# EAGLE design SAM 15x15 v4 (EAGLE 7.6.0)
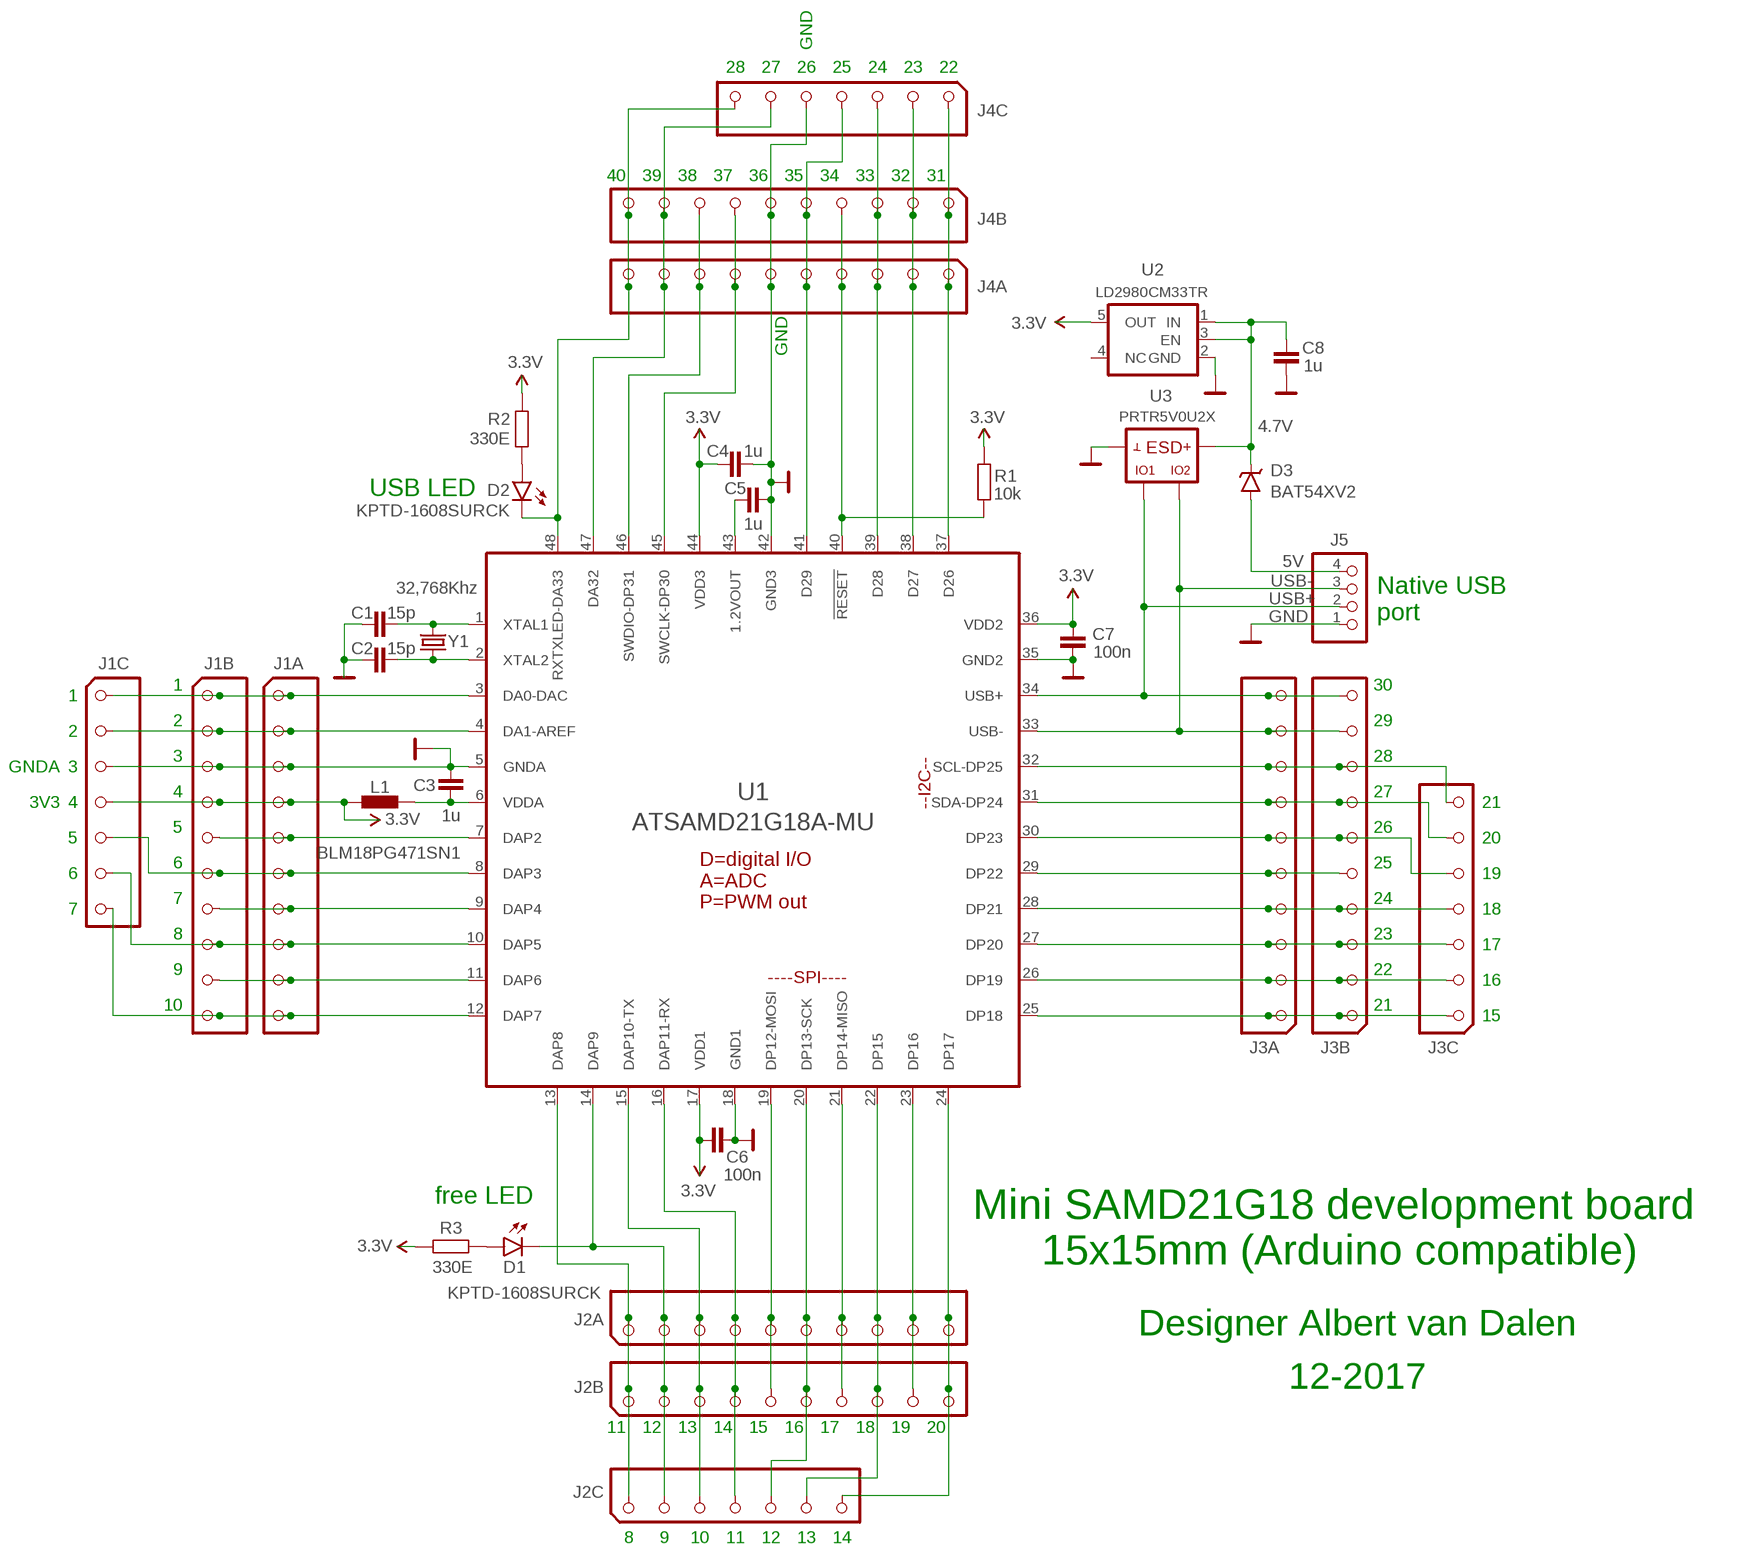
[diagram p0: schematic, sheet 1]
V1 (ARROW): VALUE: x
V2 (ARROW): VALUE: x
V3 (ARROW): VALUE: x
V4 (ARROW): VALUE: x
V5 (ARROW): VALUE: x
V11 (ARROW): VALUE: x
V12 (ARROW): VALUE: x
V98 (ARROW): VALUE: x

## Parts
C1  15p  SMD-C-0402-SMALL  [0402-SMALL]
C2  15p  SMD-C-0402-SMALL  [0402-SMALL]
C3  1u  SMD-C-0402-SMALL  [0402-SMALL]
C4  1u  SMD-C-0402-SMALL  [0402-SMALL]
C5  1u  SMD-C-0402-SMALL  [0402-SMALL]
C6  100n  SMD-C-0402-SMALL  [0402-SMALL]
C7  100n  SMD-C-0402-SMALL  [0402-SMALL]
C8  1u  SMD-C-0402-SMALL  [0402-SMALL]
D1  KPTD-1608SURCK  LED  [LED-0603]
D2  KPTD-1608SURCK  LED  [LED-0603]
D3  BAT54XV2  DIODE-SMDSOD523  [SOD523]
J1A  JST-10SAM50  [1.27MM-10P-SAM50]
J1B  JST-101X10  [1X10]
J1C  SAM7SAM7  [SAM7]
J2A  JST-10SAM50  [1.27MM-10P-SAM50]
J2B  JST-101X10  [1X10]
J2C  SAM7SAM7  [SAM7]
J3A  JST-10SAM50  [1.27MM-10P-SAM50]
J3B  JST-101X10  [1X10]
J3C  SAM7SAM7  [SAM7]
J4A  JST-10SAM50  [1.27MM-10P-SAM50]
J4B  JST-101X10  [1X10]
J4C  SAM7SAM7  [SAM7]
J5  Header 4p  JST-41X04  [1X04]
L1  BLM18PG471SN1  ARDUINO_INDUCTOR-0603  [ARDUINO_C0603]
R1  10k  SMD-R-0402-SMALL  [0402-SMALL]
R2  330E  SMD-R-0402-SMALL  [0402-SMALL]
R3  330E  SMD-R-0402-SMALL  [0402-SMALL]
U1  ATSAMD21G18A-MU  ATSAMD21G-M  [QFN-48]
U2  LD2980CM33TR  AP2112K-3.3TRG1  [SOT23-5]
U3  PRTR5V0U2X  [SOT143B]
Y1  32,768Khz  CRYSTAL-SMD  [CRYSTAL-SMD-3.2X1.5MM]

## Nets
3.3V: C4.2 C6.2 C7.2 J1A.4 J1B.4 J1C.4 L1.1 R1.2 R2.2 R3.2 U1.17(VDD1) U1.36(VDD2) U1.44(VDD3) U2.5(OUT)
4.7V: C8.2 D3.C U2.1(IN) U2.3(EN) U3.4(VCC)
5V: D3.A J5.4
GND: C1.2 C2.2 C3.2 C4.1 C5.1 C6.1 C7.1 C8.1 J1A.3 J1B.3 J1C.3 J4A.6 J4B.6 J4C.5 J5.1 U1.5(GNDA) U1.18(GND1) U1.35(GND2) U1.42(GND3) U2.2(GND) U3.1(GND) ; supply symbol labelled GND2
N$1: D2.A R2.1
N$2: J2A.8 J2B.8 J2C.6 U1.22(DP15)
N$3: J1A.1 J1B.1 J1C.1 U1.3(DA0-DAC)
N$4: J1A.2 J1B.2 J1C.2 U1.4(DA1-AREF)
N$5: J1A.5 J1B.5 U1.7(DAP2)
N$6: J1A.6 J1B.6 J1C.5 U1.8(DAP3)
N$7: J1A.7 J1B.7 U1.9(DAP4)
N$9: J2A.3 J2B.3 J2C.3 U1.15(DAP10-TX)
N$10: J1A.8 J1B.8 J1C.6 U1.10(DAP5)
N$11: D1.C J2A.2 J2B.2 J2C.2 U1.14(DAP9)
N$12: J2A.1 J2B.1 J2C.1 U1.13(DAP8)
N$13: J2A.5 J2B.5 U1.19(DP12-MOSI)
N$14: J3A.5 J3B.5 U1.29(DP22)
N$15: J2A.7 J2B.7 U1.21(DP14-MISO)
N$16: J3A.7 J3B.7 J3C.6 U1.31(SDA-DP24)
N$17: J2A.9 J2B.9 U1.23(DP16)
N$18: J3A.1 J3B.1 J3C.1 U1.25(DP18)
N$19: J3A.2 J3B.2 J3C.2 U1.26(DP19)
N$20: J3A.3 J3B.3 J3C.3 U1.27(DP20)
N$21: J3A.4 J3B.4 J3C.4 U1.28(DP21)
N$24: J1A.9 J1B.9 U1.11(DAP6)
N$25: J3A.8 J3B.8 J3C.7 U1.32(SCL-DP25)
N$26: D1.A R3.1
N$27: J2A.6 J2B.6 J2C.5 U1.20(DP13-SCK)
N$29: J1A.10 J1B.10 J1C.7 U1.12(DAP7)
N$30: J4A.5 J4B.5 J4C.4 U1.41(D29)
N$31: J4A.4 J4B.4 R1.1 U1.40(!RESET!)
N$32: J4A.7 J4B.7 U1.45(SWCLK-DP30)
N$33: J4A.8 J4B.8 U1.46(SWDIO-DP31)
N$35: D2.C J4A.10 J4B.10 J4C.7 U1.48(RXTXLED-DA33)
N$36: J4A.3 J4B.3 J4C.3 U1.39(D28)
N$37: J4A.2 J4B.2 J4C.2 U1.38(D27)
N$38: J2A.10 J2B.10 J2C.7 U1.24(DP17)
N$39: J4A.1 J4B.1 J4C.1 U1.37(D26)
N$43: J2A.4 J2B.4 J2C.4 U1.16(DAP11-RX)
N$44: J3A.6 J3B.6 J3C.5 U1.30(DP23)
N$47: J4A.9 J4B.9 J4C.6 U1.47(DA32)
N$68: C1.1 U1.1(XTAL1) Y1.P$2
N$109: C2.1 U1.2(XTAL2) Y1.P$1
N$111: C5.2 U1.43(1.2VOUT)
USB+: J3A.10 J3B.10 J5.2 U1.34(USB+) U3.3(IO1)
USB-: J3A.9 J3B.9 J5.3 U1.33(USB-) U3.2(IO2)
VDDA: C3.1 L1.2 U1.6(VDDA)
Unconnected: U2.4(NC)

## Notes on the sheet
- GND
- 28 | 27 | 26 | 25 | 24 | 23 | 22
- 40 | 39 | 38 | 37 | 36 | 35 | 34 | 33 | 32 | 31
- GND
- USB LED
- Native USB 
  port
- 1 | 30
- 1
- 2 | 29
- 2
- 3 | 28
- GNDA | 3
- 4 | 27
- 3V3 | 4 | 21
- 5 | 26
- 5 | 20
- 6 | 25
- 6 | 19
- 7 | 24
- 7 | 18
- 8 | 23
- 17
- 9 | 22
- 16
- 10 | 21
- 15
- free LED
- Mini SAMD21G18 development board 
  15x15mm (Arduino compatible)
- Designer Albert van Dalen
- 12-2017
- 11 | 12 | 13 | 14 | 15 | 16 | 17 | 18 | 19 | 20
- 8 | 9 | 10 | 11 | 12 | 13 | 14

## Library data of the parts
C1-C8 = Albert:SMD-C: Capacitors ...4.7uF @ 6.3V -> 0402 ...10uF @ 16V -> 0603 ...22uF @ 25V -> 0805
D1 D2 = Albert:LED
D3 = Albert:DIODE-SMD
J1A J1B J2A J2B J3A J3B J4A J4B = Albert:JST-10
J1C J2C J3C J4C = Albert:SAM7
J5 = Albert:JST-4
L1 = Arduino-Zero:ARDUINO_INDUCTOR: Inductors
R1-R3 = Albert:SMD-R: Resistors all kinds in 0603 and 0402
U1 = Albert-Arduino:ATSAMD21G: Atmel SAMD21G SMART ARM-Based Microcontroller The Atmel ® | SMART  SAM D21 is a series of low-power microcontrollers using the 32-bit ARM ® Cortex ® -M0+ processor, and ranging from 32- to 64-pins with up to 256KB Flash and 32KB of SRAM. The SAM D21 devices operate at a maximum frequency of 48MHz and reach 2.46 CoreMark/MHz. They are designed for simple and intuitive migration with identical peripheral modules, hex compatible code, identical linear address map and pin compatible migration paths between all devices in the product series. All devices include intelligent and flexible peripherals, Atmel Event System for inter-peripheral signaling, and support for capacitive touch button, slider and wheel user interfaces.
U2 = Albert:AP2112K: Voltage Regulator LDO Standard 150mA LDO voltage regulator in SOT-23 layout. Micrel part MIC5205. BP (by-pass) pin is used to lower output noise with 470pF cap.
U3 = Albert:PRTR5V0U2X
Y1 = Albert:CRYSTAL-SMD: 32,768KHz - SMD

## Net classes
2 GND: width 0.406 mm
3 usbvcc: width 0.102 mm, drill 0.1 mm, clearance 0.15 mm

## Board
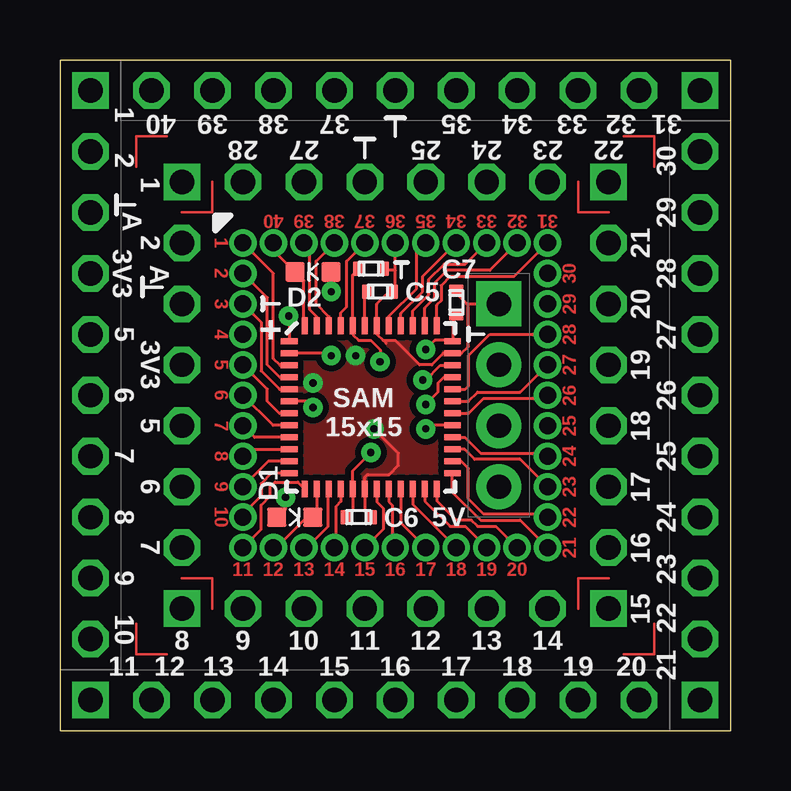
[diagram p1: board, top side]
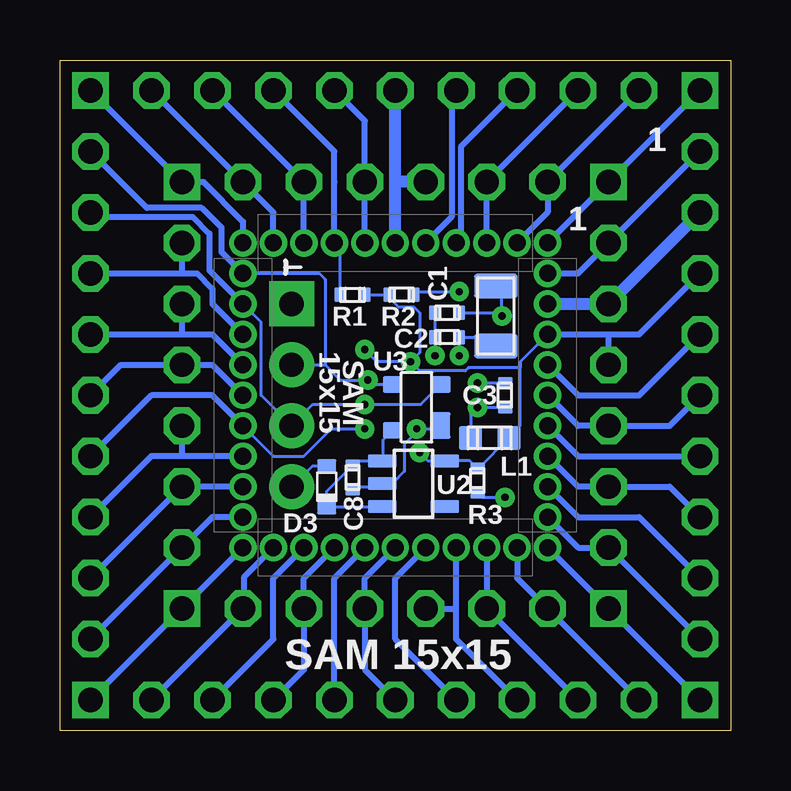
[diagram p2: board, bottom side, seen from below]

Size 27.94 x 27.94 mm. Coordinates in mm from the lower left corner, seen from the top.
Outline: 0,0 27.94,0 27.94,27.94 0,27.94 0,0
Copper layers (1*16): Top 0.035mm / dielectric 1.5mm / Bottom 0.035mm
Design rules "Albert 5mil": minimum track width 5mil, minimum drill 0.3mm, track to track 5mil, track to pad 5mil, pad to pad 5mil, via to via 5mil, smd to smd 5mil, copper to edge 10mil, drill to drill 8mil, minimum pad ring 8.5mil, minimum via ring 10mil, stop-mask expansion 4mil, vias tented up to drill 25mil, thermal gap 10mil

### Footprints (pad centres in the part's own frame; a part is rotated, then mirrored left to right if it is on the bottom)
0402-SMALL = smd 0.6 x 0.5: 1 0,0.5; 2 0,-0.5
LED-0603 = smd 0.8 x 0.8: A 0,-0.75; C 0,0.75
SOD523 = smd 0.6 x 0.8: A 0.85,0; C -0.85,0
1.27MM-10P-SAM50 = drill 0.7 pad 1.143: 1 0,0; 2 1.27,0; 3 2.54,0; 4 3.81,0; 5 5.08,0; 6 6.35,0; 7 7.62,0; 8 8.89,0; 9 10.16,0; 10 11.43,0
1X10 = drill 1.016 square: 1 0,0 | drill 1.016 octagon: 2 2.54,0; 3 5.08,0; 4 7.62,0; 5 10.16,0; 6 12.7,0; 7 15.24,0; 8 17.78,0; 9 20.32,0; 10 22.86,0
SAM7 = drill 1.016 square: 1 0,0 | drill 1.016 octagon: 2 2.54,0; 3 5.08,0; 4 7.62,0; 5 10.16,0; 6 12.7,0; 7 15.24,0
1X04 = drill 1.016 pad 1.88 square: 1 0,0 | drill 1.016 pad 1.88: 2 2.54,0; 3 5.08,0; 4 7.62,0
ARDUINO_C0603 = smd 1 x 0.95: 1 0,0.8; 2 0,-0.8
QFN-48 = smd 0.7 x 0.25: 1 -3.4,2.75; 2 -3.4,2.25; 3 -3.4,1.75; 4 -3.4,1.25; 5 -3.4,0.75; 6 -3.4,0.25; 7 -3.4,-0.25; 8 -3.4,-0.75; 9 -3.4,-1.25; 10 -3.4,-1.75; 11 -3.4,-2.25; 12 -3.4,-2.75; 25 3.4,-2.75; 26 3.4,-2.25; 27 3.4,-1.75; 28 3.4,-1.25; 29 3.4,-0.75; 30 3.4,-0.25; 31 3.4,0.25; 32 3.4,0.75; 33 3.4,1.25; 34 3.4,1.75; 35 3.4,2.25; 36 3.4,2.75 | smd 0.25 x 0.7: 13 -2.75,-3.4; 14 -2.25,-3.4; 15 -1.75,-3.4; 16 -1.25,-3.4; 17 -0.75,-3.4; 18 -0.25,-3.4; 19 0.25,-3.4; 20 0.75,-3.4; 21 1.25,-3.4; 22 1.75,-3.4; 23 2.25,-3.4; 24 2.75,-3.4; 37 2.75,3.4; 38 2.25,3.4; 39 1.75,3.4; 40 1.25,3.4; 41 0.75,3.4; 42 0.25,3.4; 43 -0.25,3.4; 44 -0.75,3.4; 45 -1.25,3.4; 46 -1.75,3.4; 47 -2.25,3.4; 48 -2.75,3.4
SOT23-5 = smd 0.55 x 1.2: 1 -0.95,-1.3; 2 0,-1.3; 3 0.95,-1.3; 4 0.95,1.3; 5 -0.95,1.3
SOT143B = smd 1.1 x 0.8: 1 -0.75,-1 | smd 0.7 x 0.8: 2 0.95,-1; 3 0.95,1; 4 -0.95,1
CRYSTAL-SMD-3.2X1.5MM = smd 1 x 1.8: P$1 -1.25,0; P$2 1.25,0

### Placement (x,y rotation side)
C1  11.81,17.4 270 bottom
C2  11.81,16.38 270 bottom
C3  9.4,13.97 180 bottom
C4  12.95,19.24 270 top
C5  13.34,18.29 270 top
C6  12.45,8.89 270 top
C7  16.51,17.84 0 top
C8  15.75,10.54 180 bottom
D1  9.78,8.89 270 top
D2  10.54,19.11 90 top
D3  16.83,10.16 90 bottom
J1A  7.62,20.32 270 top
J1B  1.27,26.67 270 top
J1C  5.08,22.86 270 top
J2A  7.62,7.62 0 top
J2B  1.27,1.27 0 top
J2C  5.08,5.08 0 top
J3A  20.32,7.62 90 top
J3B  26.67,1.27 90 top
J3C  22.86,5.08 90 top
J4A  20.32,20.32 180 top
J4B  26.67,26.67 180 top
J4C  22.86,22.86 180 top
J5  18.29,17.78 270 top
L1  10.03,12.19 270 bottom
R1  15.75,18.16 90 bottom
R2  13.72,18.16 270 bottom
R3  10.54,10.41 180 bottom
U1  12.95,13.46 0 top
U2  13.21,10.29 270 bottom
U3  13.08,13.46 90 bottom
Y1  9.78,17.27 90 bottom

### Tracks (layer width: path | path; a pad name or v marks a point on that pad's centre or on a via)
3.3V  (via drill 0.3)
  Top 0.127: C6.2 12.2,9.15 U1.17 12.19,10.07 12.19,10.82 v12.95,11.58 | U1.44 12.2,18.99 C4.2 | U1.36 16.13,16.18 16.26,16.26 | U1.44 | 16.26,16.26 15.62,16.26 v15.24,15.88 | U1.44 12.2,16.5 12.45,16.26 12.95,16.26 13.34,15.88 v13.34,15.37 | 16.26,16.26 16.38,16.26 16.38,17.22 C7.2
  Bottom 0.127: 8.76,15.11 10.92,15.11 11.05,14.99 12.95,14.99 v13.34,15.37 | 9.14,12.03 L1.1 | L1.1 9.11,12.36 8.76,12.7 8.76,15.11 | R1.2 R2.2 14.22,18.03 13.84,17.65 13.21,17.65 12.95,17.4 12.95,15.75 v13.34,15.37 | J1A.4 8.76,15.37 8.76,15.11 | v12.95,11.58 12.61,11.24 U2.5 10.86,11.24 R3.2 10.51,10.91 L1.1 | v13.34,15.37 14.73,15.37 v15.24,15.88
  Bottom 0.254: J1A.4 5.08,16.51 | 5.08,16.51 3.81,16.51 J1B.4 | J1C.4 5.08,16.51
4.7V
  Bottom 0.127: 14.69,11.29 U2.1 | U2.1 15.68,11.24 C8.2 16.83,9.97 D3.C 14.66,9.31 U2.3 | U2.1 14.48,11.27 14.48,12.12 U3.4
5V
  Bottom 0.127: D3.A 17.44,11.01 J5.4
GND  (via drill 0.3)
  Top 0.127: 13.2,17.78 U1.42 13.21,16.51 13.46,16.26 | 13.2,17.78 13.58,18.15 C5.1 13.97,18.42 13.97,19.18 | 13.97,19.18 J4A.6 | C6.1 12.7,9.13 U1.18 12.7,10.54 12.83,10.67 13.72,10.67 14.1,11.05 14.1,11.56 v13.08,12.57 | J1A.3 8.38,17.02 8.38,14.99 9.16,14.21 U1.5 | 13.97,19.18 13.52,19.18 C4.1 | 13.2,17.78 13.21,17.77 | 13.46,16.26 13.97,16.26 14.99,15.24 15.49,15.24 15.97,15.71 U1.35 16.73,15.71 17.02,16 17.02,17.78 | 13.46,16.26 13.59,16.13 | 17.02,17.78 J5.1 | 17.02,17.78 16.95,17.78 16.51,18.22 C7.1
  Bottom 0.127: C1.2 C2.2 12.31,15.76 v12.32,15.62 | C3.2 v10.54,14.48 | U3.1 12.09,12.57 v13.08,12.57 13.08,12.45 13.59,11.94 13.59,10.79 14.1,10.29 U2.2 | 14.64,10.29 U2.2 | C8.1 15.75,10.16 14.63,10.16 U2.2 | 14.99,10.29 U2.2
  Bottom 0.508: J1A.3 J1C.3 J1B.3 | J4A.6 13.97,22.86 | 13.97,22.86 J4B.6 | J4C.5 13.97,22.86
  pour Top (isolate 0.254): 9.4,17.02 16.51,17.02 16.51,9.91 9.4,9.91
N$1  (via drill 0.3)
  Top 0.127: v11.3,18.29 v11.29,18.3 D2.A
  Bottom 0.127: R2.1 13.09,18.29 v11.3,18.29
N$2
  Top 0.127: U1.22 14.7,9.43 J2A.8
  Bottom 0.254: J2B.8 17.78,2.54 J2C.6 17.78,6.35 J2A.8
N$3
  Top 0.127: U1.3 9.17,15.21 8.89,15.49 8.89,19.05 J1A.1
  Bottom 0.254: J1A.1 J1C.1 J1B.1
N$4
  Top 0.127: U1.4 9.16,14.71 8.64,15.24 8.64,18.03 J1A.2
  Bottom 0.254: J1A.2 6.35,19.05 J1C.2 J1B.2
N$5
  Top 0.127: U1.7 9.14,13.21 8.64,13.72 8.64,14.22 J1A.5
  Bottom 0.254: J1A.5 6.35,13.97 3.81,13.97 J1B.5
N$6
  Top 0.127: U1.8 8.88,12.71 J1A.6
  Bottom 0.254: J1B.6 2.54,12.7 J1C.5 6.35,12.7 J1A.6
N$7
  Top 0.127: U1.9 8.11,12.21 J1A.7
  Bottom 0.254: J1A.7 6.35,11.43 J1B.7
N$8
  Top 0.102: 24.77,23.5 24.77,24.77 23.5,24.77
N$9
  Top 0.127: U1.15 11.18,10.03 11.18,8.51 10.29,7.62 J2A.3
  Bottom 0.254: J2A.3 J2C.3 J2B.3
N$10
  Top 0.127: J1A.8 7.9,11.71 U1.10
  Bottom 0.254: J1A.8 6.35,10.16 J1C.6 2.54,10.16 J1B.8
N$11
  Top 0.127: U1.14 10.7,9.06 D1.C 10.29,8.89 9.02,7.62 J2A.2
  Bottom 0.254: J2A.2 8.89,6.35 7.68,5.14 J2C.2 J2B.2
N$12
  Top 0.127: U1.13 10.2,10.2 | J2A.1 8.38,8.38 8.38,9.4 8.76,9.78 8.76,10.16 8.95,10.35 9.91,10.35 U1.13 | U1.13 10.16,10.11
  Bottom 0.254: J2A.1 5.59,5.59 J2C.1 J2B.1
N$13
  Top 0.127: U1.19 13.2,9.53 13.46,9.27 13.46,8.38 J2A.5
  Bottom 0.254: J2B.5 13.97,3.81 13.97,6.35 J2A.5
N$14  (via drill 0.3)
  Top 0.127: U1.29 15.38,12.71 v15.24,12.57
  Bottom 0.127: J3A.5 19.05,11.43 17.78,11.43 16.64,12.57 v15.24,12.57
  Bottom 0.254: J3A.5 21.59,13.97 24.13,13.97 J3B.5
N$15
  Top 0.127: U1.21 14.2,8.66 J2A.7
  Bottom 0.254: J2B.7 16.51,6.35 J2A.7
N$16
  Top 0.127: J3A.7 19.18,14.1 17.4,14.1 17.01,13.71 U1.31
  Bottom 0.254: J3B.7 22.86,16.51 | 22.86,16.51 21.59,16.51 J3A.7 | J3C.6 22.86,16.51
N$17
  Top 0.127: U1.23 15.2,9.56 16.26,8.51 16.89,8.51 J2A.9
  Bottom 0.254: J2B.9 19.05,3.81 19.05,6.35 J2A.9
N$18
  Top 0.127: J3A.1 19.18,8.76 17.53,8.76 16.35,9.94 U1.25
  Bottom 0.254: J3B.1 J3C.1 J3A.1
N$19
  Top 0.127: J3A.2 20.19,9.02 17.65,9.02 17.02,9.65 17.02,10.92 16.73,11.21 U1.26
  Bottom 0.254: J3A.2 21.59,8.89 J3C.2 J3B.2
N$20
  Top 0.127: J3A.3 19.18,11.3 17.27,11.3 16.86,11.71 U1.27
  Bottom 0.254: J3A.3 J3C.3 J3B.3
N$21
  Top 0.127: J3A.4 20.19,11.56 17.53,11.56 16.87,12.21 U1.28
  Bottom 0.254: J3A.4 22.86,11.43 | 22.86,11.43 24.13,11.43 J3B.4 | J3C.4 22.86,11.43
N$22
  Top 0.102: 4.45,24.77 3.17,24.77 3.17,23.5
N$23
  Top 0.102: 3.17,4.45 3.17,3.17 4.45,3.17
N$24
  Top 0.127: U1.11 8.67,11.21 J1A.9
  Bottom 0.254: J1B.9 3.81,8.89 6.35,8.89 J1A.9
N$25
  Top 0.127: U1.32 16.88,14.21 17.02,14.35 17.02,15.62 17.91,16.51 J3A.8
  Bottom 0.254: J3B.8 22.86,19.05 | 22.86,19.05 22.23,19.05 21.59,18.41 21.59,17.78 J3A.8 | J3C.7 22.86,19.05
N$26  (via drill 0.3)
  Top 0.127: D1.A 9.4,9.26 v9.4,9.72
  Bottom 0.127: R3.1 10.34,9.72 v9.4,9.72
N$27
  Top 0.127: U1.20 13.7,9.54 13.84,9.4 13.84,7.75 J2A.6
  Bottom 0.254: J2B.6 15.24,2.54 J2C.5 15.24,6.35 J2A.6
N$28
  Top 0.102: 6.35,22.86 6.35,21.59 5.08,21.59
N$29
  Top 0.127: U1.12 8.81,10.71 8.38,10.29 8.38,9.78 7.62,9.02 J1A.10
  Bottom 0.254: J1A.10 6.35,7.62 J1C.7 J1B.10
N$30
  Top 0.127: U1.41 13.7,17.26 14.86,18.41 14.86,19.94 J4A.5
  Bottom 0.254: J4A.5 J4C.4 15.24,25.4 J4B.5
N$31
  Top 0.127: U1.40 14.2,17.38 15.11,18.29 15.11,18.92 J4A.4
  Bottom 0.127: R1.1 16.26,20.07 J4A.4
  Bottom 0.254: J4A.4 16.51,22.86 16.51,24.13 J4B.4
N$32
  Top 0.127: 12.45,20.07 J4A.7 11.94,19.56 11.94,17.65 11.7,17.42 U1.45
  Bottom 0.254: J4B.7 11.62,26.48 11.62,21.4 J4A.7
N$33
  Top 0.127: U1.46 11.2,17.24 10.67,17.78 10.67,19.56 J4A.8
  Bottom 0.254: J4B.8 11.24,24.32 11.24,20.51 J4A.8
N$35
  Top 0.127: U1.48 10.16,16.91 10.16,18.74 D2.C 8.89,20.02 J4A.10
  Bottom 0.254: J4A.10 7.62,21.59 J4C.7 J4B.10
N$36
  Top 0.127: J4A.3 16.89,19.43 16,19.43 15.37,18.8 15.37,18.16 14.7,17.5 U1.39
  Bottom 0.254: J4A.3 J4C.3 J4B.3
N$37
  Top 0.127: U1.38 15.2,17.62 15.62,18.03 15.62,18.67 16.13,19.18 17.91,19.18 J4A.2
  Bottom 0.254: J4A.2 19.05,21.59 J4C.2 J4B.2
N$38
  Top 0.127: U1.24 15.7,9.57 16.51,8.76 17.14,8.76 17.4,8.51 18.16,8.51 J2A.10
  Bottom 0.254: J2B.10 J2C.7 20.26,5.14 20.26,6.41 J2A.10
N$39
  Top 0.127: J4A.1 18.92,18.92 16.26,18.92 15.88,18.54 15.88,17.91 15.7,17.74 U1.37
  Bottom 0.254: J4B.1 J4C.1 21.97,22.86 20.32,21.21 J4A.1
N$40
  Top 0.102: 21.59,22.86 21.59,21.59 22.86,21.59
N$41
  Top 0.102: 5.08,6.35 6.35,6.35 6.35,5.08
N$42
  Top 0.102: 22.86,6.35 21.59,6.35 21.59,5.08
N$43
  Top 0.127: U1.16 11.7,9.54 11.49,9.34 11.49,7.68 J2A.4
  Bottom 0.254: J2B.4 11.43,3.81 11.43,5.08 | 11.43,5.08 J2A.4 | J2C.4 11.43,5.08
N$44
  Top 0.127: U1.30 17.02,13.21 17.65,13.84 20.19,13.84 J3A.6
  Bottom 0.254: J3A.6 21.59,15.24 J3C.5 25.4,15.24 J3B.6
N$45
  Top 0.102: 23.5,3.17 24.77,3.17 24.77,4.45
N$47
  Top 0.127: U1.47 10.7,17.24 10.41,17.53 10.41,20.07 J4A.9
  Bottom 0.254: J4B.9 J4C.6 J4A.9
N$68  (via drill 0.3)
  Top 0.127: v9.53,17.27 9.55,17.24 U1.1
  Bottom 0.127: Y1.P$2 9.53,18.27 v9.53,17.27 9.65,17.4 C1.1
N$109  (via drill 0.3)
  Top 0.127: U1.2 9.59,15.75 11.18,15.75 v11.3,15.62
  Bottom 0.127: C2.1 11.31,15.5 v11.3,15.62 C2.1 9.89,16.38 Y1.P$1
N$111
  Top 0.127: U1.43 12.7,18.29 C5.2
USB+  (via drill 0.3)
  Top 0.127: v15.11,14.61 15.24,14.61 15.85,15.21 U1.34
  Bottom 0.127: J3A.10 17.14,19.05 16.89,18.8 16.89,15.24 | 16.89,15.24 16.26,14.61 v15.11,14.61 14.92,14.41 U3.3 | J5.2 16.89,15.24
  Bottom 0.254: J3A.10 21.21,19.94 21.21,20.95 22.04,21.78 24.32,21.78 J3B.10
USB-  (via drill 0.3)
  Top 0.127: U1.33 15.98,14.71 15.75,14.48 15.75,14.1 v15.24,13.59
  Bottom 0.127: J3A.9 19.56,17.02 19.56,13.97 J5.3 17.4,13.59 v15.24,13.59 12.9,13.59 U3.2
  Bottom 0.254: J3B.9 26.48,21.4 22.42,21.4 21.72,20.7 21.72,19.18 J3A.9
VDDA  (via drill 0.3)
  Top 0.127: v10.54,13.46 10.29,13.72 U1.6
  Bottom 0.127: C3.1 v10.53,13.47 v10.54,13.46 10.83,13.17 L1.2

### Text on the board
Top: 40 | 39 | 38 | 37 | 36 | 35 | 34 | 33 | 32 | 31 | 1 | 2 | 30 | 3 | 29 | 4 | 28 | 5 | 27 | 6 | 26 | 7 | 25 | 8 | 24 | 9 | 23 | 10 | 22 | 21 | 11 | 12 | 13 | 14 | 15 | 16 | 17 | 18 | 19 | 20
tNames: 1 | 40 | 39 | 38 | 37 | 35 | 34 | 33 | 32 | 31 | 28 | 27 | 25 | 24 | 23 | 22 | 2 | 30 | 1 | 29 | A | 3V3 | 2 | 21 | A | 28 | 20 | 5 | + | 27 | 3V3 | 19 | 6 | 26 | 5 | 18 | SAM / 15x15 | 7 | 25 | 6 | 17 | 8 | 5V | 24 | 7 | 16 | 23 | 9 | 15 | 22 | 10 | 8 | 9 | 10 | 11 | 12 | 13 | 14 | 21 | 11 | 12 | 13 | 14 | 15 | 16 | 17 | 18 | 19 | 20
bNames: 1 | 1 | SAM / 15x15 | SAM 15x15
Document: 15,24mm